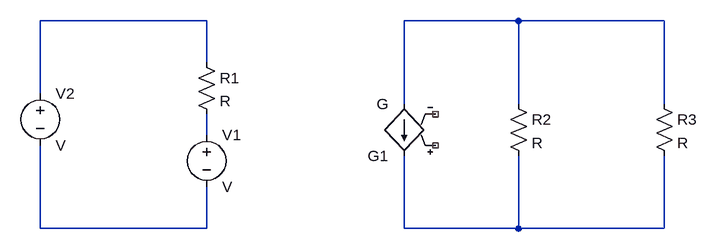
[diagram p0: schematic 3-2.asc]
3-2.asc, the LTspice schematic file:
Version 4.1
SHEET 1 880 680
WIRE 96 16 -160 16
WIRE 576 16 400 16
WIRE 800 16 576 16
WIRE 96 80 96 16
WIRE -160 128 -160 16
WIRE 400 144 400 16
WIRE 576 144 576 16
WIRE 800 144 800 16
WIRE 96 192 96 160
WIRE -160 336 -160 208
WIRE 96 336 96 272
WIRE 96 336 -160 336
WIRE 400 336 400 224
WIRE 576 336 576 224
WIRE 576 336 400 336
WIRE 800 336 800 224
WIRE 800 336 576 336
SYMBOL res 80 64 R0
SYMATTR InstName R1
SYMBOL voltage 96 176 R0
SYMATTR InstName V1
SYMBOL g 400 240 R180
SYMATTR InstName G1
SYMBOL res 560 128 R0
SYMATTR InstName R2
SYMBOL voltage -160 112 R0
SYMATTR InstName V2
SYMBOL res 784 128 R0
SYMATTR InstName R3

The netlist it stands for:
* 3-2.asc
R1 N001 N003 R
V1 N003 N004 V
G1 N002 N005 NC_01 NC_02 G
R2 N002 N005 R
V2 N001 N004 V
R3 N002 N005 R
.backanno
.end